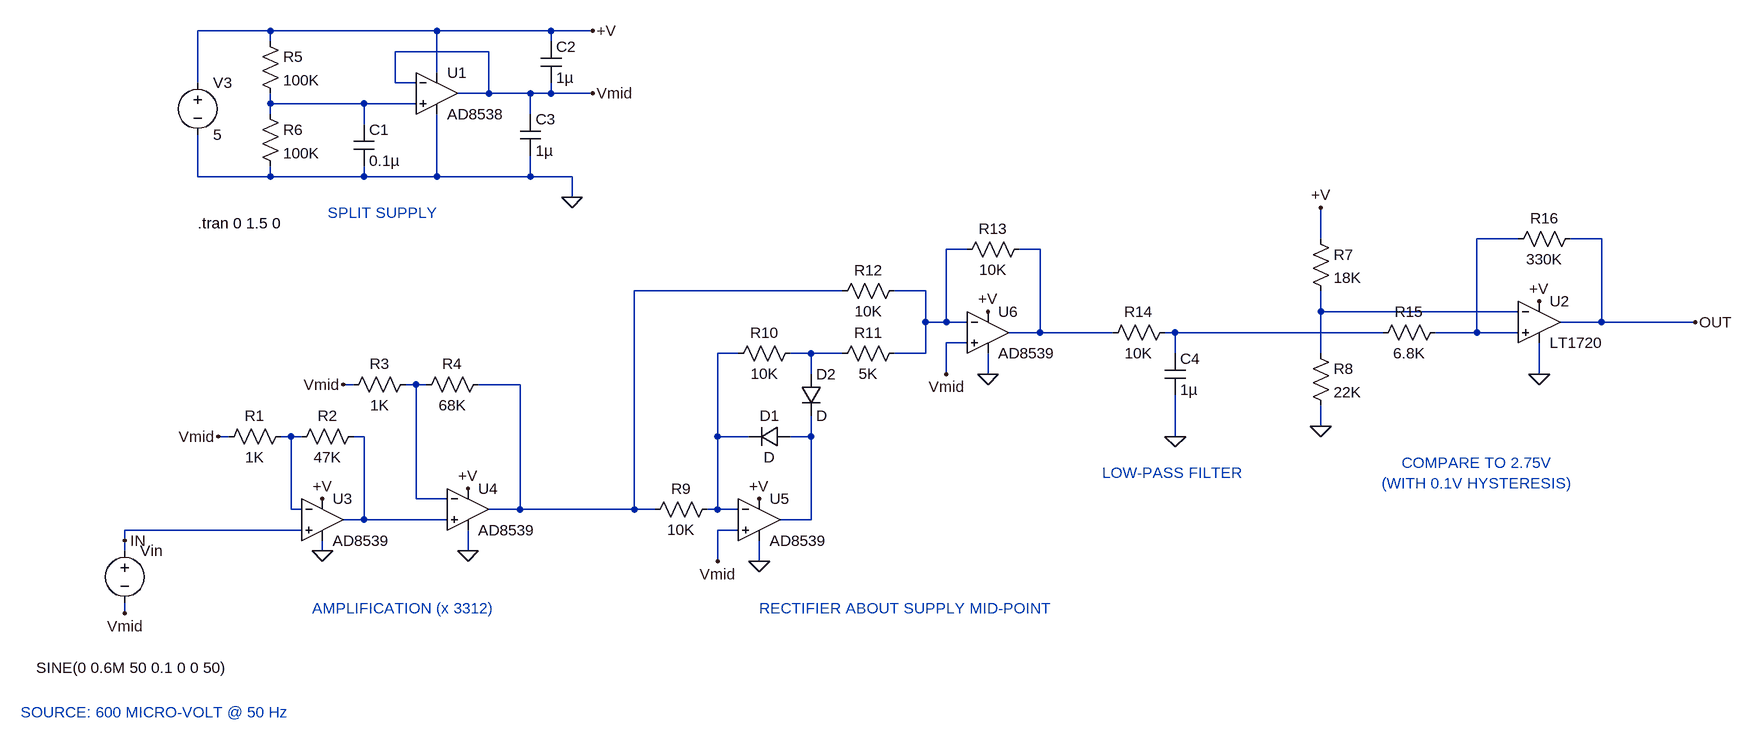
[diagram p0: schematic rogowski-coil-final.asc]
rogowski-coil-final.asc, the LTspice schematic file:
Version 4
SHEET 1 2860 700
WIRE 496 -1856 384 -1856
WIRE 752 -1856 496 -1856
WIRE 928 -1856 752 -1856
WIRE 992 -1856 928 -1856
WIRE 496 -1840 496 -1856
WIRE 928 -1840 928 -1856
WIRE 832 -1824 688 -1824
WIRE 752 -1792 752 -1856
WIRE 384 -1776 384 -1856
WIRE 688 -1776 688 -1824
WIRE 720 -1776 688 -1776
WIRE 832 -1760 832 -1824
WIRE 832 -1760 784 -1760
WIRE 896 -1760 832 -1760
WIRE 928 -1760 928 -1776
WIRE 928 -1760 896 -1760
WIRE 992 -1760 928 -1760
WIRE 496 -1744 496 -1760
WIRE 640 -1744 496 -1744
WIRE 720 -1744 640 -1744
WIRE 496 -1728 496 -1744
WIRE 896 -1728 896 -1760
WIRE 640 -1712 640 -1744
WIRE 384 -1632 384 -1696
WIRE 496 -1632 496 -1648
WIRE 496 -1632 384 -1632
WIRE 640 -1632 640 -1648
WIRE 640 -1632 496 -1632
WIRE 752 -1632 752 -1728
WIRE 752 -1632 640 -1632
WIRE 896 -1632 896 -1664
WIRE 896 -1632 752 -1632
WIRE 960 -1632 896 -1632
WIRE 960 -1600 960 -1632
WIRE 2112 -1536 2112 -1584
WIRE 2416 -1536 2352 -1536
WIRE 2544 -1536 2496 -1536
WIRE 1568 -1520 1536 -1520
WIRE 1680 -1520 1648 -1520
WIRE 1376 -1456 1056 -1456
WIRE 1504 -1456 1456 -1456
WIRE 2112 -1424 2112 -1456
WIRE 2416 -1424 2112 -1424
WIRE 1504 -1408 1504 -1456
WIRE 1536 -1408 1536 -1520
WIRE 1536 -1408 1504 -1408
WIRE 1568 -1408 1536 -1408
WIRE 2544 -1408 2544 -1536
WIRE 2544 -1408 2480 -1408
WIRE 2688 -1408 2544 -1408
WIRE 1680 -1392 1680 -1520
WIRE 1680 -1392 1632 -1392
WIRE 1792 -1392 1680 -1392
WIRE 1888 -1392 1872 -1392
WIRE 2208 -1392 1888 -1392
WIRE 2352 -1392 2352 -1536
WIRE 2352 -1392 2288 -1392
WIRE 2416 -1392 2352 -1392
WIRE 1568 -1376 1536 -1376
WIRE 1216 -1360 1184 -1360
WIRE 1328 -1360 1296 -1360
WIRE 1376 -1360 1328 -1360
WIRE 1504 -1360 1504 -1408
WIRE 1504 -1360 1456 -1360
WIRE 1888 -1360 1888 -1392
WIRE 2112 -1360 2112 -1424
WIRE 1328 -1328 1328 -1360
WIRE 1536 -1328 1536 -1376
WIRE 1600 -1328 1600 -1360
WIRE 2448 -1328 2448 -1376
WIRE 624 -1312 608 -1312
WIRE 720 -1312 704 -1312
WIRE 736 -1312 720 -1312
WIRE 880 -1312 816 -1312
WIRE 2112 -1248 2112 -1280
WIRE 432 -1232 416 -1232
WIRE 528 -1232 512 -1232
WIRE 544 -1232 528 -1232
WIRE 640 -1232 624 -1232
WIRE 1184 -1232 1184 -1360
WIRE 1232 -1232 1184 -1232
WIRE 1328 -1232 1328 -1264
WIRE 1328 -1232 1296 -1232
WIRE 1888 -1232 1888 -1296
WIRE 720 -1136 720 -1312
WIRE 768 -1136 720 -1136
WIRE 528 -1120 528 -1232
WIRE 544 -1120 528 -1120
WIRE 880 -1120 880 -1312
WIRE 880 -1120 832 -1120
WIRE 1056 -1120 1056 -1456
WIRE 1056 -1120 880 -1120
WIRE 1088 -1120 1056 -1120
WIRE 1184 -1120 1184 -1232
WIRE 1184 -1120 1168 -1120
WIRE 1216 -1120 1184 -1120
WIRE 640 -1104 640 -1232
WIRE 640 -1104 608 -1104
WIRE 768 -1104 640 -1104
WIRE 1328 -1104 1328 -1232
WIRE 1328 -1104 1280 -1104
WIRE 544 -1088 272 -1088
WIRE 1216 -1088 1184 -1088
WIRE 272 -1072 272 -1088
WIRE 272 -1056 272 -1072
WIRE 576 -1056 576 -1072
WIRE 800 -1056 800 -1088
WIRE 1184 -1040 1184 -1088
WIRE 1248 -1040 1248 -1072
WIRE 272 -960 272 -976
FLAG 2688 -1408 OUT
FLAG 272 -1072 IN
FLAG 576 -1136 +V
FLAG 800 -1152 +V
FLAG 960 -1600 0
FLAG 992 -1856 +V
FLAG 992 -1760 Vmid
FLAG 576 -1056 0
FLAG 800 -1056 0
FLAG 608 -1312 Vmid
FLAG 416 -1232 Vmid
FLAG 272 -960 Vmid
FLAG 2448 -1328 0
FLAG 2448 -1440 +V
FLAG 2112 -1248 0
FLAG 2112 -1584 +V
FLAG 1888 -1232 0
FLAG 1248 -1040 0
FLAG 1248 -1136 +V
FLAG 1600 -1328 0
FLAG 1600 -1424 +V
FLAG 1536 -1328 Vmid
FLAG 1184 -1040 Vmid
SYMBOL voltage 272 -1072 R0
WINDOW 123 24 146 Left 2
WINDOW 39 24 125 Left 2
WINDOW 3 -136 196 Left 2
SYMATTR Value SINE(0 0.6M 50 0.1 0 0 50)
SYMATTR InstName Vin
SYMBOL res 528 -1248 R90
WINDOW 0 0 56 VBottom 2
WINDOW 3 32 56 VTop 2
SYMATTR InstName R1
SYMATTR Value 1K
SYMBOL res 640 -1248 R90
WINDOW 0 0 56 VBottom 2
WINDOW 3 32 56 VTop 2
SYMATTR InstName R2
SYMATTR Value 47K
SYMBOL res 1888 -1408 R90
WINDOW 0 0 56 VBottom 2
WINDOW 3 32 56 VTop 2
SYMATTR InstName R14
SYMATTR Value 10K
SYMBOL res 720 -1328 R90
WINDOW 0 0 56 VBottom 2
WINDOW 3 32 56 VTop 2
SYMATTR InstName R3
SYMATTR Value 1K
SYMBOL res 832 -1328 R90
WINDOW 0 0 56 VBottom 2
WINDOW 3 32 56 VTop 2
SYMATTR InstName R4
SYMATTR Value 68K
SYMBOL OpAmps\\AD8539 576 -1168 R0
SYMATTR InstName U3
SYMBOL OpAmps\\AD8539 800 -1184 R0
SYMATTR InstName U4
SYMBOL voltage 384 -1792 R0
WINDOW 123 0 0 Left 0
WINDOW 39 0 0 Left 0
SYMATTR InstName V3
SYMATTR Value 5
SYMBOL res 480 -1856 R0
SYMATTR InstName R5
SYMATTR Value 100K
SYMBOL res 480 -1744 R0
SYMATTR InstName R6
SYMATTR Value 100K
SYMBOL OpAmps\\AD8538 752 -1824 R0
SYMATTR InstName U1
SYMBOL cap 624 -1712 R0
SYMATTR InstName C1
SYMATTR Value 0.1µ
SYMBOL cap 912 -1840 R0
SYMATTR InstName C2
SYMATTR Value 1µ
SYMBOL cap 880 -1728 R0
SYMATTR InstName C3
SYMATTR Value 1µ
SYMBOL Comparators\\LT1720 2448 -1472 R0
SYMATTR InstName U2
SYMBOL res 2096 -1552 R0
SYMATTR InstName R7
SYMATTR Value 18K
SYMBOL res 2096 -1376 R0
SYMATTR InstName R8
SYMATTR Value 22K
SYMBOL cap 1872 -1360 R0
SYMATTR InstName C4
SYMATTR Value 1µ
SYMBOL OpAmps\\AD8539 1248 -1168 R0
SYMATTR InstName U5
SYMBOL res 1184 -1136 R90
WINDOW 0 0 56 VBottom 2
WINDOW 3 32 56 VTop 2
SYMATTR InstName R9
SYMATTR Value 10K
SYMBOL diode 1296 -1248 R90
WINDOW 0 0 32 VBottom 2
WINDOW 3 32 32 VTop 2
SYMATTR InstName D1
SYMBOL diode 1312 -1328 R0
SYMATTR InstName D2
SYMBOL res 1312 -1376 R90
WINDOW 0 0 56 VBottom 2
WINDOW 3 32 56 VTop 2
SYMATTR InstName R10
SYMATTR Value 10K
SYMBOL res 1472 -1376 R90
WINDOW 0 0 56 VBottom 2
WINDOW 3 32 56 VTop 2
SYMATTR InstName R11
SYMATTR Value 5K
SYMBOL res 1472 -1472 R90
WINDOW 0 0 56 VBottom 2
WINDOW 3 32 56 VTop 2
SYMATTR InstName R12
SYMATTR Value 10K
SYMBOL OpAmps\\AD8539 1600 -1456 R0
SYMATTR InstName U6
SYMBOL res 1664 -1536 R90
WINDOW 0 0 56 VBottom 2
WINDOW 3 32 56 VTop 2
SYMATTR InstName R13
SYMATTR Value 10K
SYMBOL res 2304 -1408 R90
WINDOW 0 0 56 VBottom 2
WINDOW 3 32 56 VTop 2
SYMATTR InstName R15
SYMATTR Value 6.8K
SYMBOL res 2512 -1552 R90
WINDOW 0 0 56 VBottom 2
WINDOW 3 32 56 VTop 2
SYMATTR InstName R16
SYMATTR Value 330K
TEXT 384 -1560 Left 2 !.tran 0 1.5 0
TEXT 584 -1576 Left 2 ;SPLIT SUPPLY
TEXT 560 -968 Left 2 ;AMPLIFICATION (x 3312)
TEXT 1248 -968 Left 2 ;RECTIFIER ABOUT SUPPLY MID-POINT
TEXT 2352 -1176 Center 2 ;COMPARE TO 2.75V\n(WITH 0.1V HYSTERESIS)
TEXT 112 -808 Left 2 ;SOURCE: 600 MICRO-VOLT @ 50 Hz
TEXT 1776 -1176 Left 2 ;LOW-PASS FILTER

The netlist it stands for:
* rogowski-coil-final.asc
Vin IN Vmid SINE(0 0.6M 50 0.1 0 0 50)
R1 N011 Vmid 1K
R2 N012 N011 47K
R14 N007 N004 10K
R3 N010 Vmid 1K
R4 N005 N010 68K
XU3 IN N011 +V 0 N012 AD8539  ; pins In+ In- V+ V- OUT
XU4 N012 N010 +V 0 N005 AD8539  ; pins In+ In- V+ V- OUT
V3 +V 0 5
R5 +V N001 100K
R6 N001 0 100K
XU1 N001 Vmid +V 0 Vmid AD8538  ; pins In+ In- V+ V- OUT
C1 N001 0 0.1µ
C2 +V Vmid 1µ
C3 Vmid 0 1µ
XU2 N002 N006 +V 0 OUT LT1720  ; pins In+ In- V+ V- OUT
R7 +V N006 18K
R8 N006 0 22K
C4 N007 0 1µ
XU5 Vmid N008 +V 0 N013 AD8539  ; pins In+ In- V+ V- OUT
R9 N008 N005 10K
D1 N013 N008 D
D2 N009 N013 D
R10 N009 N008 10K
R11 N003 N009 5K
R12 N003 N005 10K
XU6 Vmid N003 +V 0 N004 AD8539  ; pins In+ In- V+ V- OUT
R13 N004 N003 10K
R15 N002 N007 6.8K
R16 OUT N002 330K
.model D D
.lib standard.dio
.tran 0 1.5 0
* SPLIT SUPPLY
* AMPLIFICATION (x 3312)
* RECTIFIER ABOUT SUPPLY MID-POINT
* COMPARE TO 2.75V
* (WITH 0.1V HYSTERESIS)
* SOURCE: 600 MICRO-VOLT @ 50 Hz
* LOW-PASS FILTER
.lib LT1720.sub
.backanno
.end